# Altium schematic sheet Encoders_In.SchDoc
size 420 x 297 mm; DocumentNumber: САНП.*; _Razrabotal: {Разработал}; _Proveril: {Проверил}; _TKontr: {Т.контр}; _NKontr: {Н.контр}; _Utverdil: {Утвердил}
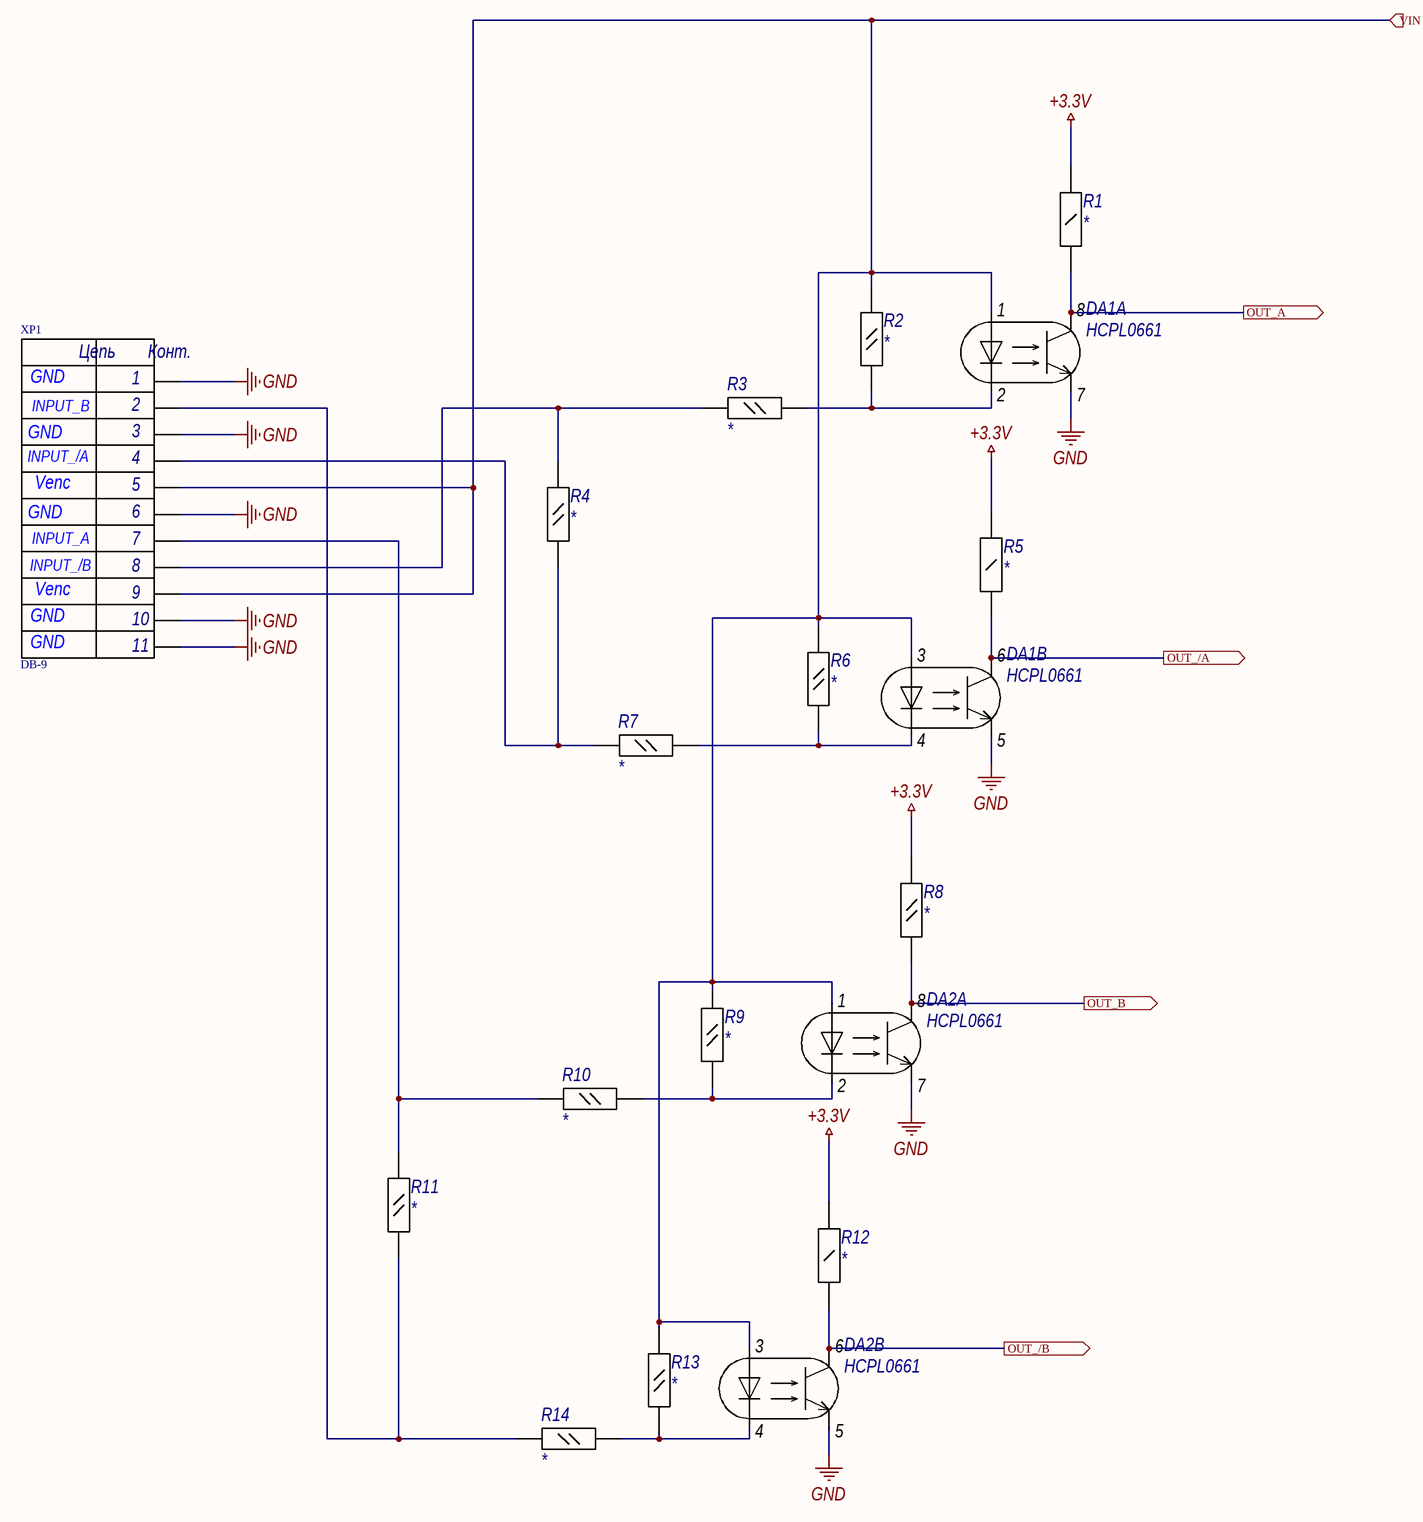
[diagram p0: Encoders_In.SchDoc]

## Parts
DA1  HCPL0661  [SO8N_MS012AA-II]  (parts A,B of 2)
DA2  HCPL0661  [SO8N_MS012AA-II]  (parts A,B of 2)
R1  *  [1206]
R2  *  [0805]
R3  *  [0805]
R4  *  [0805]
R5  *  [1206]
R6  *  [0805]
R7  *  [0805]
R8  *  [0805]
R9  *  [0805]
R10  *  [0805]
R11  *  [0805]
R12  *  [1206]
R13  *  [0805]
R14  *  [0805]
XP1  DB-9  [DB-9M]

## Ports
OUT_/A, OUT_/B (out), OUT_A (out), OUT_B (out), VIN (in)

## Nets
+3.3V: R1.2 R5.2 R8.2 R12.2
GND: DA1.5(E2) DA1.7(E1) DA2.5(E2) DA2.7(E1) XP1.1 XP1.3 XP1.6 XP1.10 XP1.11
OUT_/A: DA1.6(C2) R5.1 ; port OUT_/A
OUT_/B: DA2.6(C2) R12.1 ; port OUT_/B
OUT_A: DA1.8(C1) R1.1 ; port OUT_A
OUT_B: DA2.8(C1) R8.1 ; port OUT_B
VIN: DA1.1(ANODE1) DA1.3(ANODE2) DA2.1(ANODE1) DA2.3(ANODE2) R2.2 R6.2 R9.2 R13.2 XP1.5 XP1.9 ; port VIN
NetDA1_2: DA1.2(CATHODE1) R2.1 R3.2
NetDA1_4: DA1.4(CATHODE2) R6.1 R7.2
NetDA2_2: DA2.2(CATHODE1) R9.1 R10.2
NetDA2_4: DA2.4(CATHODE2) R13.1 R14.2
NetR3_1: R3.1 R4.2 XP1.8
NetR4_1: R4.1 R7.1 XP1.4
NetR10_1: R10.1 R11.2 XP1.7
NetR11_1: R11.1 R14.1 XP1.2

## Notes on the sheet
- GND
- INPUT_B
- Venc
- INPUT_/A
- INPUT_A
- INPUT_/B
- Перв. примен.
- Справ. №
- Подп. и дата
- Инв.№ дубл.
- Взам. инв.№
- Инв. № подп.
- Лист
- Изм.
- № докум.
- Подпись
- Дата
- Копировал
- Формат      А3
- (in symbol DB-9) Цепь; Конт.

## Library data of the parts
DA1 DA2 = HCPL0661: Оптопара 2 канала; Manufacturer: HP; PackageName: SO-8; ComponentType: Микросхема; ComponentName: HCPL0661
R1 R5 R12 = CRCW1206: Accuracy: 5%; PackageName: 1206; ComponentType: Резистор; Value: *; ComponentName: CRCW1206
R2-R4 R6-R11 R13 R14 = RC0805JR: Резистор общего назначения 5%; Manufacturer: YAGEO; PackageName: 0805; ComponentType: Резистор; Accuracy: 5%; Value: *; ComponentName: RC0805JR
XP1 = DB-9: Connector DB-9; ComponentName: DB-9; ComponentType: Разъём